# EAGLE schematic ringmodulator (EAGLE 6.5.0)
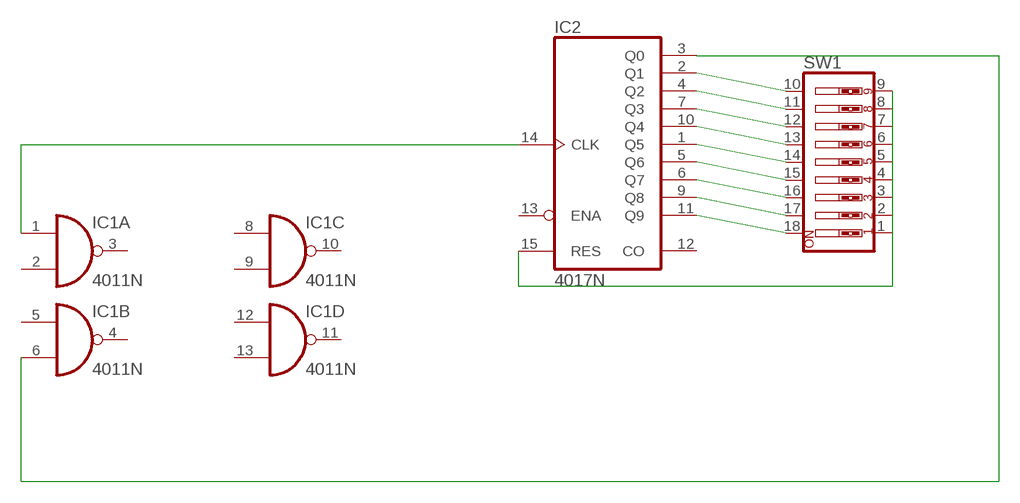
[diagram p0: schematic, sheet 1]

## Parts
IC1  4011N  [DIL14]
IC2  4017N  [DIL16]
SW1  SW_DIP-9  [EDG-09]

## Nets
N$1: IC1.1(A:I0) IC2.14(CLK)
N$2: IC1.6(B:I1) IC2.3(Q0)
N$3: IC2.2(Q1) SW1.10
N$4: IC2.4(Q2) SW1.11
N$5: IC2.7(Q3) SW1.12
N$6: IC2.10(Q4) SW1.13
N$7: IC2.1(Q5) SW1.14
N$8: IC2.5(Q6) SW1.15
N$9: IC2.6(Q7) SW1.16
N$10: IC2.9(Q8) SW1.17
N$11: IC2.11(Q9) SW1.18
N$12: IC2.15(RES) SW1.1 SW1.2 SW1.3 SW1.4 SW1.5 SW1.6 SW1.7 SW1.8 SW1.9
Unconnected: IC1.2(A:I1) IC1.3(A:O) IC1.4(B:O) IC1.5(B:I0) IC1.8(C:I0) IC1.9(C:I1) IC1.10(C:O) IC1.11(D:O) IC1.12(D:I0) IC1.13(D:I1) IC2.12(CO) IC2.13(ENA)

## Power pins joined to a net without a drawn wire
VDD: IC1.14(P:VDD) IC2.16(VDD)
VSS: IC1.7(P:VSS) IC2.8(VSS)

## Library data of the parts
IC1 = 40xx:4011: Quad 2-input NAND
IC2 = 40xx:4017: COUNTER/DIVIDER
SW1 = special:SW_DIP-9: DIP SWITCH